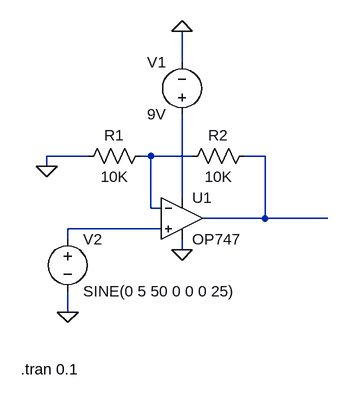
[diagram p0: schematic receiver-stage-draft.asc]
receiver-stage-draft.asc, the LTspice schematic file:
Version 4
SHEET 1 880 680
WIRE 240 -80 240 -128
WIRE 96 64 32 64
WIRE 192 64 176 64
WIRE 256 64 192 64
WIRE 368 64 336 64
WIRE 32 80 32 64
WIRE 240 128 240 0
WIRE 192 144 192 64
WIRE 208 144 192 144
WIRE 368 160 368 64
WIRE 368 160 272 160
WIRE 464 160 368 160
WIRE 208 176 64 176
WIRE 64 192 64 176
WIRE 240 208 240 192
WIRE 64 304 64 272
FLAG 240 -128 0
FLAG 240 208 0
FLAG 32 80 0
FLAG 64 304 0
SYMBOL OpAmps\\OP747 240 96 R0
SYMATTR InstName U1
SYMBOL voltage 240 16 R180
WINDOW 0 24 96 Left 2
WINDOW 3 24 16 Left 2
WINDOW 123 0 0 Left 0
WINDOW 39 0 0 Left 0
SYMATTR InstName V1
SYMATTR Value 9V
SYMBOL res 192 48 R90
WINDOW 0 0 56 VBottom 2
WINDOW 3 32 56 VTop 2
SYMATTR InstName R1
SYMATTR Value 10K
SYMBOL res 352 48 R90
WINDOW 0 0 56 VBottom 2
WINDOW 3 32 56 VTop 2
SYMATTR InstName R2
SYMATTR Value 10K
SYMBOL voltage 64 176 R0
WINDOW 123 0 0 Left 0
WINDOW 39 0 0 Left 0
SYMATTR InstName V2
SYMATTR Value SINE(0 5 50 0 0 0 25)
TEXT -8 392 Left 2 !.tran 0.1

The netlist it stands for:
* receiver-stage-draft.asc
XU1 N004 N001 N003 0 N002 OP747  ; pins In+ In- V+ V- OUT
V1 N003 0 9V
R1 N001 0 10K
R2 N002 N001 10K
V2 N004 0 SINE(0 5 50 0 0 0 25)
.tran 0.1
.backanno
.end